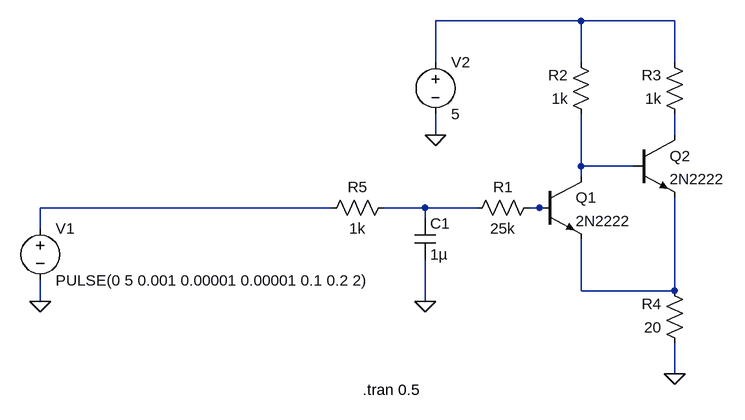
[diagram p0: schematic Schmitt_Trigger.asc]
Schmitt_Trigger.asc, the LTspice schematic file:
Version 4
SHEET 1 880 680
WIRE 240 -208 16 -208
WIRE 384 -208 240 -208
WIRE 16 -144 16 -208
WIRE 240 -144 240 -208
WIRE 384 -144 384 -208
WIRE 16 -32 16 -64
WIRE 384 -32 384 -64
WIRE 240 16 240 -64
WIRE 320 16 240 16
WIRE 240 32 240 16
WIRE -144 80 -592 80
WIRE 0 80 -64 80
WIRE 80 80 0 80
WIRE 176 80 160 80
WIRE 192 80 176 80
WIRE 0 96 0 80
WIRE -592 112 -592 80
WIRE 240 208 240 128
WIRE 384 208 384 64
WIRE 384 208 240 208
WIRE -592 224 -592 192
WIRE 0 224 0 160
WIRE 384 336 384 288
FLAG -592 224 0
FLAG 384 336 0
FLAG 16 -32 0
FLAG 0 224 0
SYMBOL res 176 64 R90
WINDOW 0 0 56 VBottom 2
WINDOW 3 32 56 VTop 2
SYMATTR InstName R1
SYMATTR Value 25k
SYMBOL res 256 -48 R180
WINDOW 0 36 76 Left 2
WINDOW 3 36 40 Left 2
SYMATTR InstName R2
SYMATTR Value 1k
SYMBOL res 400 -48 R180
WINDOW 0 36 76 Left 2
WINDOW 3 36 40 Left 2
SYMATTR InstName R3
SYMATTR Value 1k
SYMBOL res 400 304 R180
WINDOW 0 36 76 Left 2
WINDOW 3 36 40 Left 2
SYMATTR InstName R4
SYMATTR Value 20
SYMBOL npn 176 32 R0
SYMATTR InstName Q1
SYMATTR Value 2N2222
SYMBOL npn 320 -32 R0
SYMATTR InstName Q2
SYMATTR Value 2N2222
SYMBOL voltage -592 96 R0
WINDOW 123 0 0 Left 0
WINDOW 39 0 0 Left 0
SYMATTR InstName V1
SYMATTR Value PULSE(0 5 0.001 0.00001 0.00001 0.1 0.2 2)
SYMBOL voltage 16 -160 R0
WINDOW 123 0 0 Left 0
WINDOW 39 0 0 Left 0
SYMATTR InstName V2
SYMATTR Value 5
SYMBOL res -48 64 R90
WINDOW 0 0 56 VBottom 2
WINDOW 3 32 56 VTop 2
SYMATTR InstName R5
SYMATTR Value 1k
SYMBOL cap -16 96 R0
SYMATTR InstName C1
SYMATTR Value 1µ
TEXT -96 360 Left 2 !.tran 0.5

The netlist it stands for:
* Schmitt_Trigger.asc
R1 N006 N005 25k
R2 N003 N001 1k
R3 N002 N001 1k
R4 0 N007 20
Q1 N003 N006 N007 0 2N2222
Q2 N002 N003 N007 0 2N2222
V1 N004 0 PULSE(0 5 0.001 0.00001 0.00001 0.1 0.2 2)
V2 N001 0 5
R5 N005 N004 1k
C1 N005 0 1µ
.model NPN NPN
.model PNP PNP
.lib standard.bjt
.tran 0.5
.backanno
.end